# Altium schematic sheet LNA_Testboard.SchDoc
size A4
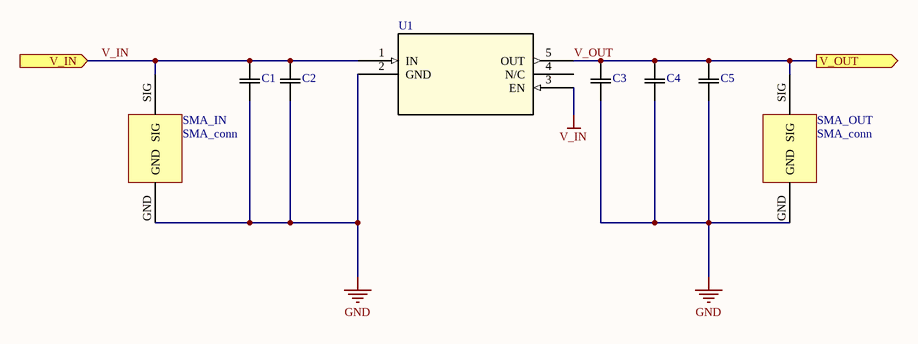
[diagram p0: LNA_Testboard.SchDoc]

## Parts
C1  (no value)  [YAG_CC0402]
C2  (no value)  [YAG_CC0402]
C3  (no value)  [YAG_CC0402]
C4  (no value)  [YAG_CC0402]
C5  (no value)  [YAG_CC0402]
SMA_IN  SMA_conn  [SMA_conn]
SMA_OUT  SMA_conn  [SMA_conn]
U1  (no value)  [DBV5]

## Ports
V_IN (in), V_OUT (out)

## Nets
GND: C1.2 C2.2 C3.2 C4.2 C5.2 SMA_IN.GND SMA_OUT.GND U1.2(GND)
V_IN: C1.1 C2.1 SMA_IN.SIG U1.1(IN) U1.3(EN) ; port V_IN
V_OUT: C3.1 C4.1 C5.1 SMA_OUT.SIG U1.5(OUT) ; port V_OUT

Not connected (* = marked no-connect by the designer): U1 4(N/C)

## Library data of the parts
C1-C5 = C0201C270J3GACTU: No Description Available; Vendor: Kemet; Built_By: EMA_UL_Team; Type: DEV; Manufacturer_Part_Number: C0201C270J3GACTU; Copyright: Copyright (C) 2018 Accelerated Designs. All rights reserved; RefDes: RefDes; Value: Value
U1 = LP5907MFX-3.3/NO: No Description Available; Manufacturer_Part_Number: LP5907MFX-3.3/NOPB; Vendor: Texas Instruments; Built_By: EMA_UL_Team; Copyright: Copyright (C) 2018 Accelerated Designs. All rights reserved; RefDes: RefDes; Type: DEV; Value: Value